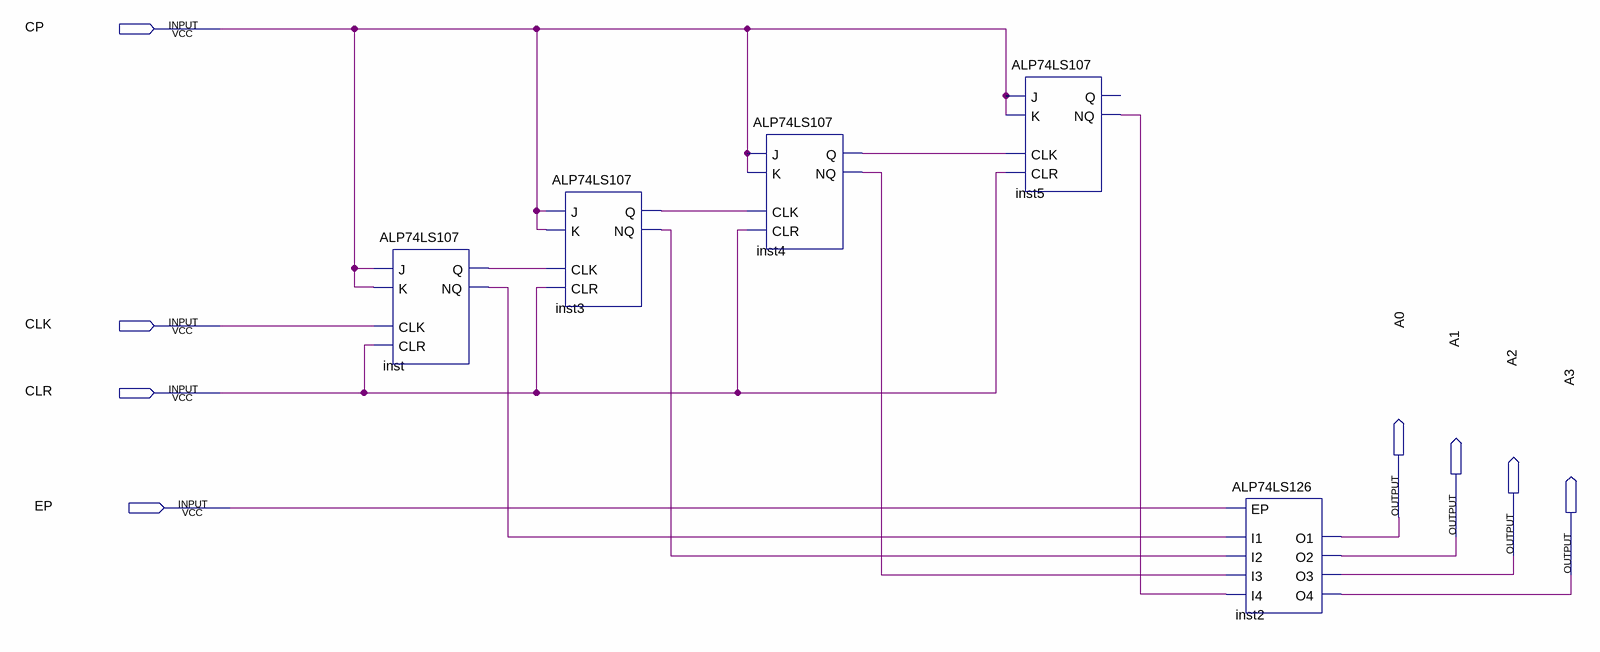
[diagram p0: schematic sheet]
// Quartus schematic ContadorDePrograma.bdf as structural Verilog: 5 symbols, 8 pins
module ContadorDePrograma (
  input  CP,
  input  CLK,
  input  CLR,
  input  EP,
  output A0,
  output A1,
  output A2,
  output A3
);

  wire inst3_nq, inst3_q, inst4_nq, inst4_q, inst5_nq, inst_nq, inst_q;

  ALP74LS107 inst (.J(CP), .CLK(CLK), .K(CP), .CLR(CLR), .Q(inst_q), .NQ(inst_nq));
  ALP74LS107 inst3 (.J(CP), .CLK(inst_q), .K(CP), .CLR(CLR), .Q(inst3_q), .NQ(inst3_nq));
  ALP74LS107 inst4 (.J(CP), .CLK(inst3_q), .K(CP), .CLR(CLR), .Q(inst4_q), .NQ(inst4_nq));
  ALP74LS107 inst5 (.J(CP), .CLK(inst4_q), .K(CP), .CLR(CLR), .NQ(inst5_nq));  // open: Q
  ALP74LS126 inst2 (
    .EP(EP), .I1(inst_nq), .I2(inst3_nq), .I3(inst4_nq), .I4(inst5_nq), .O1(A0), .O2(A1), .O3(A2), .O4(A3));
endmodule
